# Altium project MCU025A.PrjPcb (part 2 of 2)

## Sheet MCU025A_XDS110_USB_Power.SchDoc
size 431 x 279 mm; Date: Not shown in title block; ApprovedBy: Not shown in title block; CheckedBy: Not shown in title block; Author: Not shown in title block; CompanyName: Not shown in title block; Engineer: Not shown in title block; Organization: Not shown in title block; Address1: Not shown in title block; Address2: Not shown in title block; Address3: Not shown in title block; Address4: Not shown in title block; DocumentNumber: 6; Revision: Use project parameter SCH_Rev; SheetNumber: 6; SheetTotal: 8; PageSetup: Record=PageOptions|CenterHorizontal=True|CenterVertical=True|PrintScale=1.00|XCorrection=1.00|YCorrection=1.00|PrintKind=0|BorderSize=5000000|LeftOffset=0|BottomOffset=0|Orientation=2|PaperLength=1000|PaperWidth=1000|Scale=100|PaperSource=15|PrintQuality=600|MediaType=1|DitherType=10|PaperKind=Letter|PrintScaleMode=1; CurrentTime: Not shown in title block; CurrentDate: Not shown in title block; Time: Not shown in title block; DocumentFullPathAndName: Not shown in title block; DocumentName: Not shown in title block; ModifiedDate: Not shown in title block; ImagePath: Not shown in title block
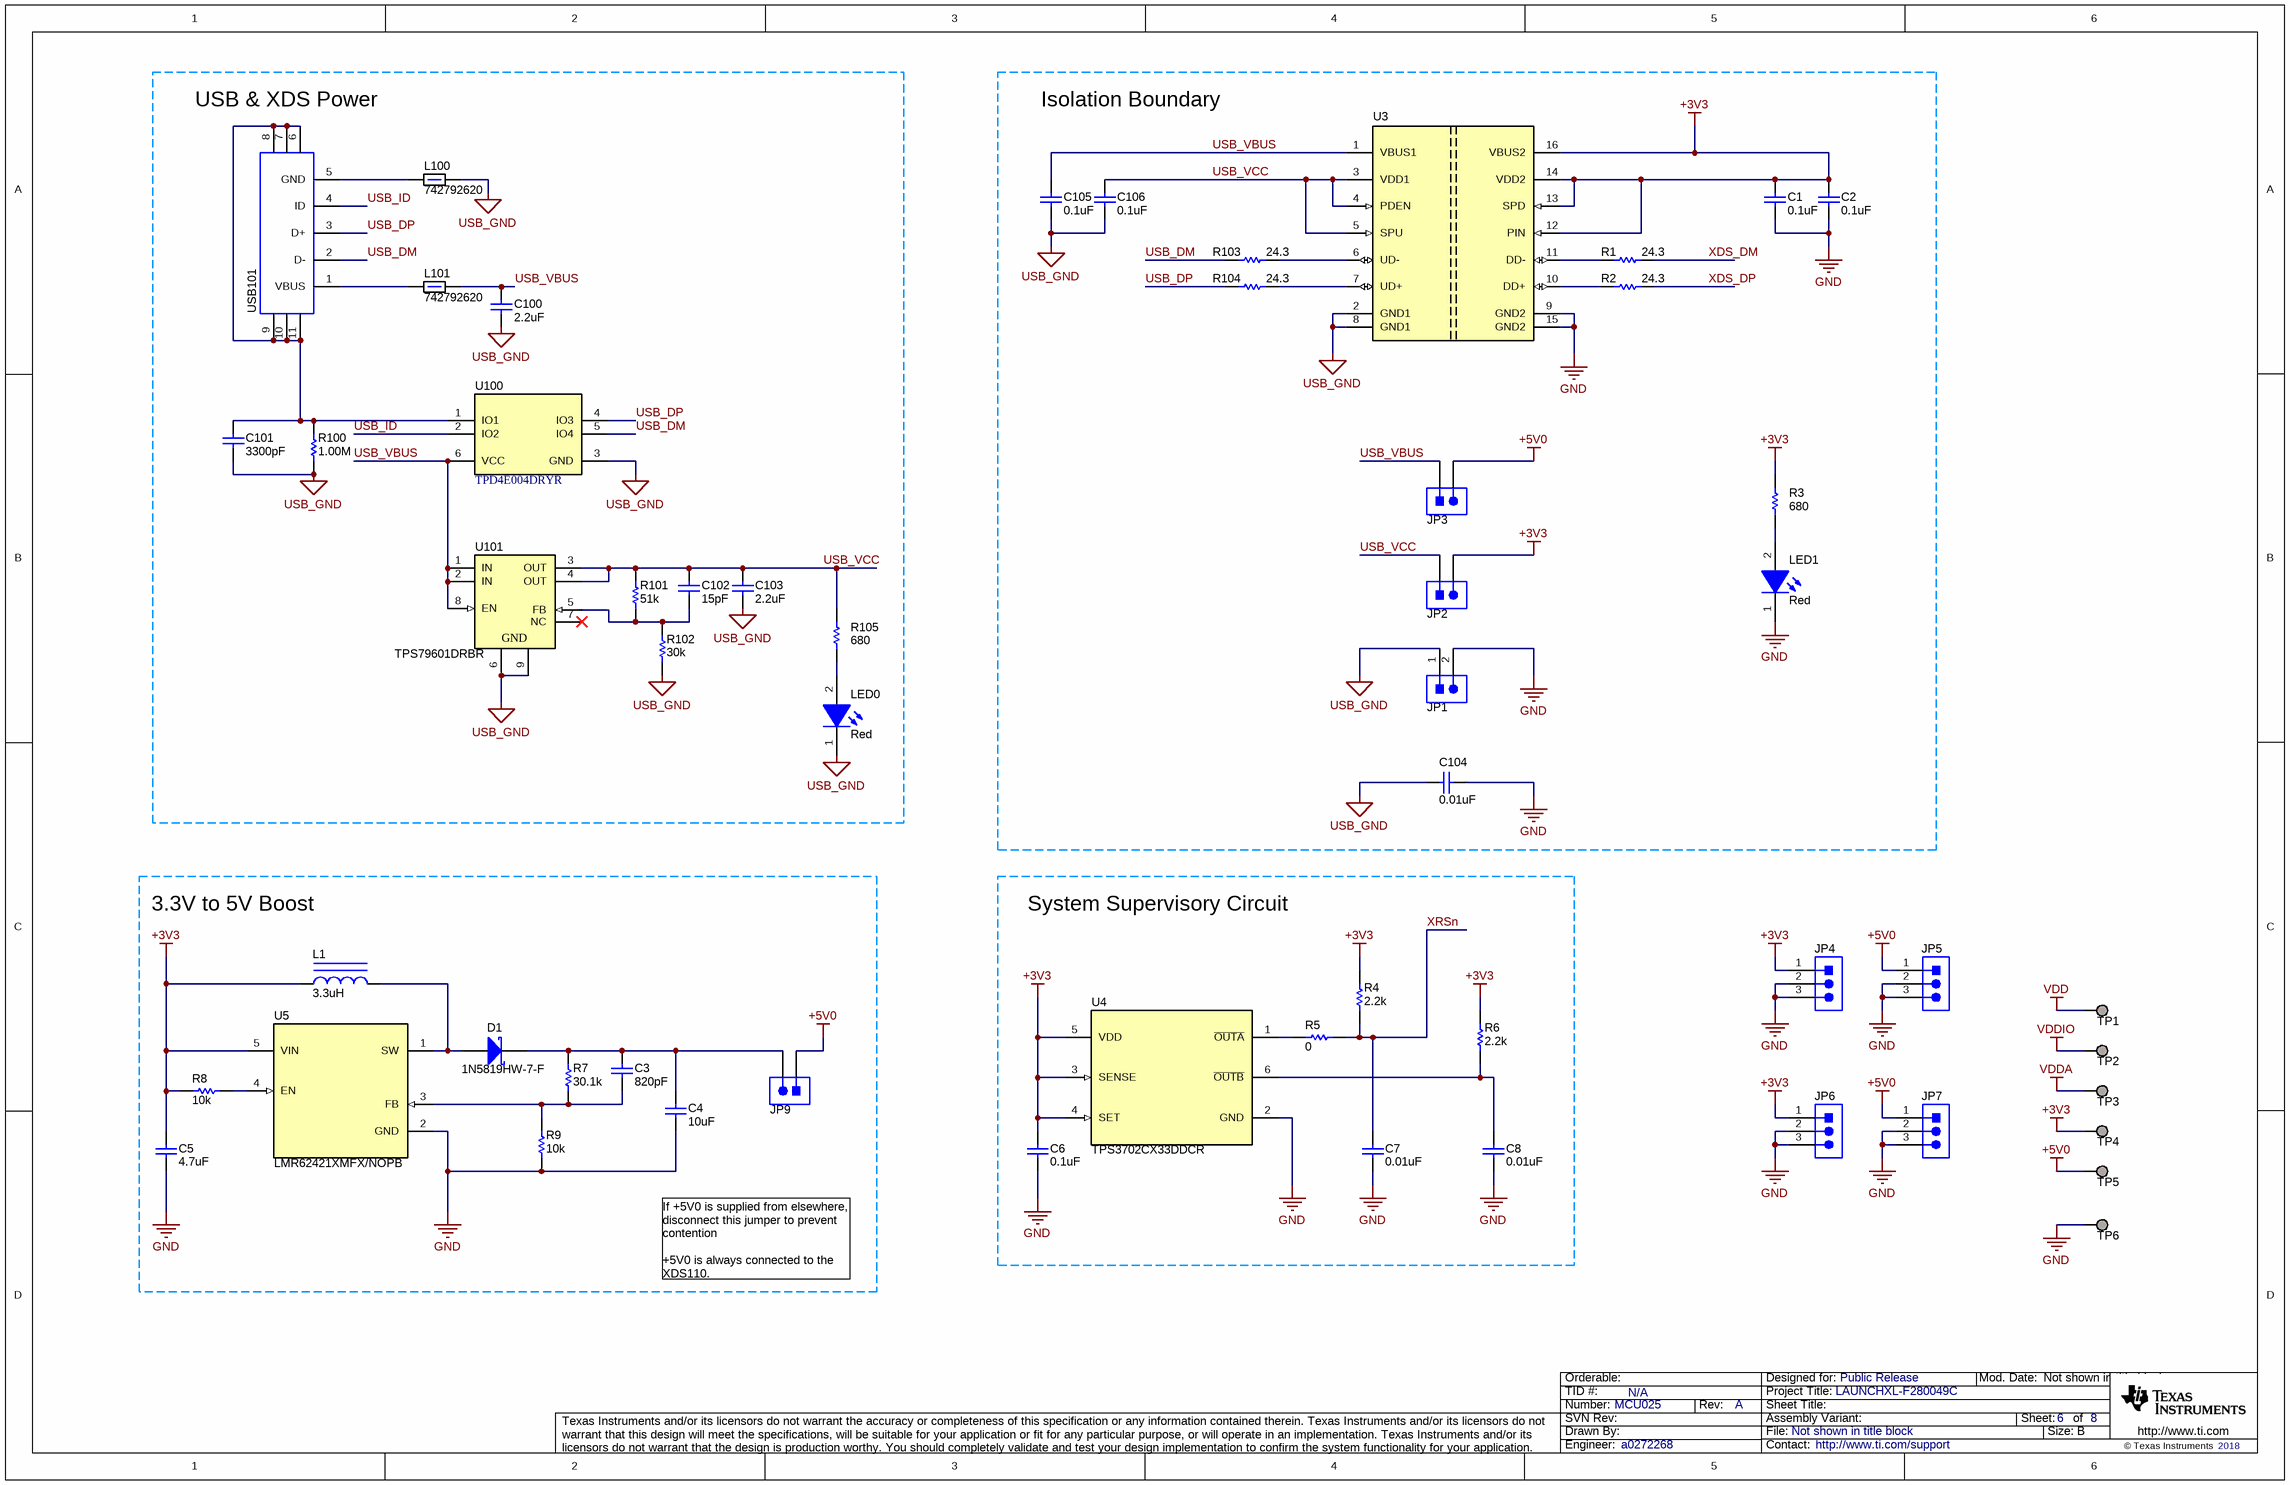
[diagram p2: MCU025A_XDS110_USB_Power.SchDoc]

### Parts
C1  ValueDisplayed: 0.1uF  [0402]  (hidden comment: GRM155R71A104KA01D)
C2  ValueDisplayed: 0.1uF  [0402]  (hidden comment: GRM155R71A104KA01D)
C3  ValueDisplayed: 820pF  [0402]  (hidden comment: GRM1555C1H821JA01D)
C4  ValueDisplayed: 10uF  [1210_220]  (hidden comment: GRM32DR71E106KA12L)
C5  ValueDisplayed: 4.7uF  [0402]  (hidden comment: GRM155R60J475ME47D)
C6  ValueDisplayed: 0.1uF  [0402]  (hidden comment: GRM155R71A104KA01D)
C7  ValueDisplayed: 0.01uF  [0402]  (hidden comment: GRM155R71E103KA01D)
C8  ValueDisplayed: 0.01uF  [0402]  (hidden comment: GRM155R71E103KA01D)
C100  ValueDisplayed: 2.2uF  [0402]  (hidden comment: GRM155R60J225KE95D)
C101  ValueDisplayed: 3300pF  [0402]  (hidden comment: GRM155R71H332KA01D)
C102  ValueDisplayed: 15pF  [0402]  (hidden comment: GRM1555C1H150JA01D)
C103  ValueDisplayed: 2.2uF  [0402]  (hidden comment: GRM155R60J225KE95D)
C104  ValueDisplayed: 0.01uF  [1812]  (hidden comment: 1812SC103KAT1A)
C105  ValueDisplayed: 0.1uF  [0402]  (hidden comment: GRM155R71A104KA01D)
C106  ValueDisplayed: 0.1uF  [0402]  (hidden comment: GRM155R71A104KA01D)
D1  1N5819HW-7-F  [SOD-123]
JP1  61300211121  [WURTH_61300211121]  (value not drawn)
JP2  61300211121  [WURTH_61300211121]  (value not drawn)
JP3  61300211121  [WURTH_61300211121]  (value not drawn)
JP4  61300311121  [WURTH_61300311121]  (value not drawn)
JP5  61300311121  [WURTH_61300311121]  (value not drawn)
JP6  61300311121  [WURTH_61300311121]  (value not drawn)
JP7  61300311121  [WURTH_61300311121]  (value not drawn)
JP9  61300211121  [WURTH_61300211121]  (value not drawn)
L1  ValueDisplayed: 3.3uH  [WE-TPC_2828]  (hidden comment: 744025003)
L100  742792620  [0603]
L101  742792620  [0603]
LED0  value Red  [WL-SMCW_RED_0805]  (hidden comment: 150080SS75000)
LED1  value Red  [WL-SMCW_RED_0805]  (hidden comment: 150080SS75000)
R1  ValueDisplayed: 24.3  [0402]  (hidden comment: CRCW040224R3FKED)
R2  ValueDisplayed: 24.3  [0402]  (hidden comment: CRCW040224R3FKED)
R3  ValueDisplayed: 680  [0402]  (hidden comment: CRCW0402680RJNED)
R4  ValueDisplayed: 2.2k  [0402]  (hidden comment: CRCW04022K20JNED)
R5  ValueDisplayed: 0  [0402]  (hidden comment: CRCW04020000Z0ED)
R6  ValueDisplayed: 2.2k  [0603]  (hidden comment: CRCW06032K20JNEA)
R7  ValueDisplayed: 30.1k  [0402]  (hidden comment: RC0402FR-0730K1L)
R8  ValueDisplayed: 10k  [0402]  (hidden comment: CRCW040210K0JNED)
R9  ValueDisplayed: 10k  [0402]  (hidden comment: CRCW040210K0JNED)
R100  ValueDisplayed: 1.00M  [0402]  (hidden comment: CRCW04021M00FKED)
R101  ValueDisplayed: 51k  [0402]  (hidden comment: CRCW040251K0JNED)
R102  ValueDisplayed: 30k  [0402]  (hidden comment: CRCW040230K0JNED)
R103  ValueDisplayed: 24.3  [0402]  (hidden comment: CRCW040224R3FKED)
R104  ValueDisplayed: 24.3  [0402]  (hidden comment: CRCW040224R3FKED)
R105  ValueDisplayed: 680  [0402]  (hidden comment: CRCW0402680RJNED)
TP1  TESTPOINT  [TESTPOINT]  (value not drawn)  (no BOM)
TP2  TESTPOINT  [TESTPOINT]  (value not drawn)  (no BOM)
TP3  TESTPOINT  [TESTPOINT]  (value not drawn)  (no BOM)
TP4  TESTPOINT  [TESTPOINT]  (value not drawn)  (no BOM)
TP5  TESTPOINT  [TESTPOINT]  (value not drawn)  (no BOM)
TP6  TESTPOINT  [TESTPOINT]  (value not drawn)  (no BOM)
U3  ADuM3160BRWZ  [SOIC-16]  (value not drawn)
U4  TPS3702CX33DDCR  [DDC0006A_N]
U5  LMR62421XMFX/NOPB  [DBV0005A_N]
U100  TPD4E004DRYR  [DRY0006A]
U101  TPS79601DRBR  [DRB0008B]
USB101  1051640001  [Molex_1051640001]  (value not drawn)

### Nets
+3V3: C1.2 C2.2 C5.1 C6.2 JP2.2 JP4.1 JP6.1 L1.1 R3.2 R4.2 R6.2 R8.2 TP4.1 U3.12(PIN) U3.13(SPD) U3.14(VDD2) U3.16(VBUS2) U4.3(SENSE) U4.4(SET) U4.5(VDD) U5.5(VIN)
+5V0: JP3.2 JP5.1 JP7.1 JP9.1 TP5.1
GND: C1.1 C2.1 C4.2 C5.2 C6.1 C7.2 C8.2 C104.1 JP1.2 JP4.2 JP4.3 JP5.2 JP5.3 JP6.2 JP6.3 JP7.2 JP7.3 LED1.1(K) R9.1 TP6.1 U3.9(GND2) U3.15(GND2) U4.2(GND) U5.2(GND)
USB_GND: C100.2 C101.2 C103.2 C104.2 C105.1 C106.1 JP1.1 L100.2 LED0.1(K) R100.1 R102.1 U3.2(GND1) U3.8(GND1) U100.3(GND) U101.6(GND) U101.9(GND)
VDD: TP1.1
VDDA: TP3.1
VDDIO: TP2.1
USB_DM: R103.1 U100.5(IO4) USB101.2(D-)
USB_DP: R104.1 U100.4(IO3) USB101.3(D+)
USB_ID: U100.2(IO2) USB101.4(ID)
USB_VBUS: C100.1 C105.2 JP3.1 L101.2 U3.1(VBUS1) U100.6(VCC) U101.1(IN) U101.2(IN) U101.8(EN)
USB_VCC: C102.1 C103.1 C106.2 JP2.1 R101.2 R105.2 U3.3(VDD1) U3.4(PDEN) U3.5(SPU) U101.3(OUT) U101.4(OUT)
XDS_DM: R1.2
XDS_DP: R2.2
XRSn: C7.1 R4.1 R5.2
NetC3_1: C3.1 C4.1 D1.1(K) JP9.2 R7.2
NetC3_2: C3.2 R7.1 R9.2 U5.3(FB)
NetC8_1: C8.1 R6.1 U4.6(~{OUTB})
NetC101_1: C101.1 R100.2 U100.1(IO1) USB101.6 USB101.7 USB101.8 USB101.9 USB101.10 USB101.11
NetC102_2: C102.2 R101.1 R102.2 U101.5(FB)
NetD1_2: D1.2(A) L1.2 U5.1(SW)
NetL100_1: L100.1 USB101.5(GND)
NetL101_1: L101.1 USB101.1(VBUS)
NetLED0_2: LED0.2(A) R105.1
NetLED1_2: LED1.2(A) R3.1
NetR1_1: R1.1 U3.11(DD-)
NetR2_1: R2.1 U3.10(DD+)
NetR5_1: R5.1 U4.1(~{OUTA})
NetR8_1: R8.1 U5.4(EN)
NetR103_2: R103.2 U3.6(UD-)
NetR104_2: R104.2 U3.7(UD+)

Not connected (* = marked no-connect by the designer): U101 7(NC)*

### Notes on the sheet
- (near USB101) USB & XDS Power
- Isolation Boundary
- 3.3V to 5V Boost
- System Supervisory Circuit
- If +5V0 is supplied from elsewhere, disconnect this jumper to prevent contention
  +5V0 is always connected to the XDS110.
- Drawn By:
- SVN Rev:
- Number:
- TID #:
- Orderable:
- Rev:
- Sheet Title:
- File:
- Project Title:
- Designed for:
- Assembly Variant:
- Mod. Date:
- Sheet:
- Size:
- of
- B
- http://www.ti.com
- Texas Instruments and/or its licensors do not warrant the accuracy or completeness of this specification or any information contained therein. Texas Instruments and/or its licensors do not warrant that this design will meet the specifications, will be suitable for your application or fit for any particular purpose, or will operate in an implementation. Texas Instruments and/or its licensors do not warrant that the design is production worthy. You should completely validate and test your design implementation to confirm the system functionality for your application.
- Engineer:
- Contact:
- © Texas Instruments

### Library data of the parts
C1 C2 C6 C105 C106 = CMP-0006629-2: CAP, CERM, 0.1 uF, 10 V, +/- 10%, X7R, 0402; Manufacturer: MuRata; Polarized: N; Value: 0.1uF; U/M: EA; Cap_F: 100nF; Value1: Unknown; VDC_V: 10V; TaMin_C: -55°C; TaMax_C: 125°C; SizeArea_mm2: 0.5; SizeAreaWB_mm2: 3; SizeX_mm: 1; SizeZ_mm: 0.6; AEC Category: Q200; CompType: Capacitor; PartNumber: GRM155R71A104KA01D; PackageReference: 0402; RoHS: Y; Tolerance_%: 10%; Value2: 10V; MountType: SMT; Technology: Ceramic; TempCo: X7R; Cap_Case: 0402; SizeY_mm: 0.5; Published: 2008-06-19; Publisher: Texas Instruments; LatestRevisionDate: 2017-03-09; ComponentLink1Description: Datasheet link; ComponentLink1URL: http://search.murata.co.jp/Ceramy/PnsearchViewAction.do?HnOFG=ON&HnNFG=ON&SEL_CNT=50&sLang=en&sKey=GRM155R71A104KA01D&x=9&y=9&search=startwith; Supplier 1: Digi-Key; Supplier Part Number 1: GRM155R71A104KA01D-ND; Supplier 2: Newark; Supplier Part Number 2: 14T3278; Supplier 3: Mouser; Supplier Part Number 3: 81-GRM155R71A104KA1D; AEC Qualified: ?
C3 = CMP-0006493-2: CAP, CERM, 820 pF, 50 V, +/- 5%, C0G/NP0, 0402; Manufacturer: MuRata; Polarized: N; Value: 820pF; U/M: EA; Value1: Unknown; VDC_V: 50V; TaMin_C: -55°C; TaMax_C: 125°C; SizeArea_mm2: 0.5; SizeAreaWB_mm2: 3; SizeX_mm: 1; SizeZ_mm: 0.6; AEC Category: Q200; CompType: Capacitor; PartNumber: GRM1555C1H821JA01D; PackageReference: 0402; RoHS: Y; Cap_F: 820pF; Tolerance_%: 5%; Value2: 50V; MountType: SMT; Technology: Ceramic; TempCo: C0G/NP0; Cap_Case: 0402; SizeY_mm: 0.5; Published: 2008-06-19; Publisher: Texas Instruments; LatestRevisionDate: 2017-03-09; ComponentLink1Description: Datasheet link; ComponentLink1URL: http://search.murata.co.jp/Ceramy/PnsearchViewAction.do?HnOFG=ON&HnNFG=ON&SEL_CNT=50&sLang=en&sKey=GRM1555C1H821JA01D&x=9&y=9&search=startwith; Supplier 1: Digi-Key; Supplier Part Number 1: 490-3242-1-ND; Supplier 2: Mouser; Supplier Part Number 2: 81-GRM1555C1H821JA1D; AEC Qualified: ?
C4 = CMP-0009190-2: CAP, CERM, 10 uF, 25 V, +/- 10%, X7R, 1210; Manufacturer: MuRata; Polarized: N; Value: 10uF; U/M: EA; Cap_F: 10µF; Value1: Unknown; VDC_V: 25V; TaMin_C: -55°C; TaMax_C: 125°C; Cap_Case: 1210; SizeArea_mm2: 8; SizeAreaWB_mm2: 14.7; SizeX_mm: 3.2; SizeY_mm: 2.5; SizeZ_mm: 2.2; AEC Category: Q200; CompType: Capacitor; PartNumber: GRM32DR71E106KA12L; PackageReference: 1210; RoHS: Y; Tolerance_%: 10%; Value2: 25V; MountType: SMT; Technology: Ceramic; TempCo: X7R; Published: 2008-06-19; Publisher: Texas Instruments; LatestRevisionDate: 2017-03-09; ComponentLink1Description: Datasheet link; ComponentLink1URL: http://search.murata.co.jp/Ceramy/image/img/A01X/G101/ENG/GRM32DR71E106KA12-01.pdf; Supplier 1: Digi-Key; Supplier Part Number 1: 490-1867-1-ND; Supplier 2: Newark; Supplier Part Number 2: 14T3400; Supplier 3: Mouser; Supplier Part Number 3: 81-GRM32DR71E106KA12; AEC Qualified: N; AEC Grade: N/A
C5 = CMP-0006552-2: CAP, CERM, 4.7 uF, 6.3 V, +/- 20%, X5R, 0402; Manufacturer: MuRata; Polarized: N; Value: 4.7uF; U/M: EA; Cap_F: 4.7µF; Value1: Unknown; VDC_V: 6.3V; TaMin_C: -55°C; TaMax_C: 85°C; SizeArea_mm2: 0.5; SizeAreaWB_mm2: 3; SizeX_mm: 1; SizeZ_mm: 0.6; AEC Category: Q200; CompType: Capacitor; PartNumber: GRM155R60J475ME47D; PackageReference: 0402; RoHS: Y; Tolerance_%: 20%; Value2: 6.3V; MountType: SMT; Technology: Ceramic; TempCo: X5R; Cap_Case: 0402; SizeY_mm: 0.5; Published: 2008-06-19; Publisher: Texas Instruments; LatestRevisionDate: 2017-03-09; ComponentLink1Description: Datasheet link; ComponentLink1URL: http://www.murata.com/products/catalog/pdf/c02e.pdf; Supplier 1: Digi-Key; Supplier Part Number 1: 490-5915-1-ND; AEC Qualified: ?
C7 C8 = CMP-0006658-2: CAP, CERM, 0.01 uF, 25 V, +/- 10%, X7R, 0402; Manufacturer: MuRata; Polarized: N; Value: 0.01uF; U/M: EA; Cap_F: 10nF; Value1: Unknown; VDC_V: 25V; TaMin_C: -55°C; TaMax_C: 125°C; SizeArea_mm2: 0.5; SizeAreaWB_mm2: 3; SizeX_mm: 1; SizeZ_mm: 0.6; AEC Category: Q200; CompType: Capacitor; PartNumber: GRM155R71E103KA01D; PackageReference: 0402; RoHS: Y; Tolerance_%: 10%; Value2: 25V; MountType: SMT; Technology: Ceramic; TempCo: X7R; Cap_Case: 0402; SizeY_mm: 0.5; Published: 2008-06-19; Publisher: Texas Instruments; LatestRevisionDate: 2017-03-09; ComponentLink1Description: Datasheet link; ComponentLink1URL: http://search.murata.co.jp/Ceramy/PnsearchViewAction.do?HnOFG=ON&HnNFG=ON&SEL_CNT=50&sLang=en&sKey=GRM155R71E103KA01D&x=9&y=9&search=startwith; Supplier 1: Digi-Key; Supplier Part Number 1: 490-1312-1-ND; Supplier 2: Mouser; Supplier Part Number 2: 81-GRM36X103K25; Supplier 3: Farnell; Supplier Part Number 3: 8819734; AEC Qualified: ?
C100 C103 = CMP-0006543-2: CAP, CERM, 2.2 uF, 6.3 V, +/- 10%, X5R, 0402; Manufacturer: MuRata; Polarized: N; Value: 2.2uF; U/M: EA; Cap_F: 2.2µF; Value1: Unknown; VDC_V: 6.3V; TaMin_C: -55°C; TaMax_C: 85°C; SizeArea_mm2: 0.5; SizeAreaWB_mm2: 3; SizeX_mm: 1; SizeZ_mm: 0.6; AEC Category: Q200; CompType: Capacitor; PartNumber: GRM155R60J225KE95D; PackageReference: 0402; RoHS: Y; Tolerance_%: 10%; Value2: 6.3V; MountType: SMT; Technology: Ceramic; TempCo: X5R; Cap_Case: 0402; SizeY_mm: 0.5; Published: 2008-06-19; Publisher: Texas Instruments; LatestRevisionDate: 2017-03-09; ComponentLink1Description: Datasheet link; ComponentLink1URL: http://psearch.en.murata.com/capacitor/product/GRM155R60J225KE95%23.pdf; Supplier 1: Mouser; Supplier Part Number 1: 81-GRM155R60J225KE5D; AEC Qualified: N; AEC Grade: N/A
C101 = CMP-0006688-2: CAP, CERM, 3300 pF, 50 V, +/- 10%, X7R, 0402; Manufacturer: MuRata; Polarized: N; Value: 3300pF; U/M: EA; Cap_F: 3.3nF; Value1: Unknown; VDC_V: 50V; TaMin_C: -55°C; TaMax_C: 125°C; SizeArea_mm2: 0.5; SizeAreaWB_mm2: 3; SizeX_mm: 1; SizeZ_mm: 0.6; AEC Category: Q200; CompType: Capacitor; PartNumber: GRM155R71H332KA01D; PackageReference: 0402; RoHS: Y; Tolerance_%: 10%; Value2: 50V; MountType: SMT; Technology: Ceramic; TempCo: X7R; Cap_Case: 0402; SizeY_mm: 0.5; Published: 2008-06-19; Publisher: Texas Instruments; LatestRevisionDate: 2017-03-09; ComponentLink1Description: Datasheet link; ComponentLink1URL: http://search.murata.co.jp/Ceramy/PnsearchViewAction.do?HnOFG=ON&HnNFG=ON&SEL_CNT=50&sLang=en&sKey=GRM155R71H332KA01D&x=9&y=9&search=startwith; Supplier 1: Digi-Key; Supplier Part Number 1: 490-3248-1-ND; Supplier 2: Mouser; Supplier Part Number 2: 81-GRM36X332K50; AEC Qualified: ?
C102 = CMP-0006420-2: CAP, CERM, 15 pF, 50 V, +/- 5%, C0G/NP0, 0402; Manufacturer: MuRata; Polarized: N; Value: 15pF; U/M: EA; Value1: Unknown; VDC_V: 50V; TaMin_C: -55°C; TaMax_C: 125°C; SizeArea_mm2: 0.5; SizeAreaWB_mm2: 3; SizeX_mm: 1; SizeZ_mm: 0.6; AEC Category: Q200; CompType: Capacitor; PartNumber: GRM1555C1H150JA01D; PackageReference: 0402; RoHS: Y; Cap_F: 15pF; Tolerance_%: 5%; Value2: 50V; MountType: SMT; Technology: Ceramic; TempCo: C0G/NP0; Cap_Case: 0402; SizeY_mm: 0.5; Published: 2008-06-19; Publisher: Texas Instruments; LatestRevisionDate: 2017-03-09; ComponentLink1Description: Datasheet link; ComponentLink1URL: http://search.murata.co.jp/Ceramy/PnsearchViewAction.do?HnOFG=ON&HnNFG=ON&SEL_CNT=50&sLang=en&sKey=GRM1555C1H150JA01D&x=9&y=9&search=startwith; Supplier 1: Mouser; Supplier Part Number 1: 81-GRM1555C1H150JA1D; AEC Qualified: ?
C104 = CMP-0009297-2: CAP, CERM, 0.01 uF, 1500 V, +/- 10%, X7R, 1812; Manufacturer: AVX; Polarized: N; Value: 0.01uF; U/M: EA; Cap_F: 10nF; ESR_ohm: 0.05; Value1: 0.05 ohm; VDC_V: 1.5kV; Value2: 1500V; TaMin_C: -55°C; TaMax_C: 125°C; SizeArea_mm2: 14.4; SizeAreaWB_mm2: 23.1; SizeX_mm: 4.5; SizeY_mm: 3.2; SizeZ_mm: 1.35; AEC Category: Q200; CompType: Capacitor; PartNumber: 1812SC103KAT1A; PackageReference: 1812; RoHS: Y; Tolerance_%: 10%; MountType: SMT; Technology: Ceramic; TempCo: X7R; Cap_Case: 1812; Published: 2008-06-19; Publisher: Texas Instruments; LatestRevisionDate: 2017-03-09; ComponentLink1Description: Datasheet link; ComponentLink1URL: http://datasheets.avx.com/AVX-HV_MLCC.pdf; Supplier 1: Digi-Key; Supplier Part Number 1: 478-4735-1-ND; Supplier 2: Newark; Supplier Part Number 2: 96M1562; Supplier 3: Mouser; Supplier Part Number 3: 581-1812SC103KAT1A; AEC Qualified: N; AEC Grade: N/A
D1 = CMP-0028360-1: Diode, Schottky, 40 V, 1 A, SOD-123; Manufacturer: Diodes Inc.; U/M: EA; Vf_V: 4.5dV; Value: 40V; Value1: 1A; Value2: 0.45V; TJmax_C: 125°C; SizeAreaWB_mm2: 13.095; SizeArea_mm2: 6.545; SizeX_mm: 3.85; SizeY_mm: 1.7; SizeZ_mm: 1.35; AEC Category: Q101; Green_Lifecycle: Active; Green_REACh: Passed; CompType: Diode; PartNumber: 1N5819HW-7-F; PackageReference: SOD-123; Io_A: 1A; Vr_V: 40V; MountType: SMT; Type: Schottky; RoHS: Y; Published: 2008-06-26; Publisher: Texas Instruments; LatestRevisionDate: 2017-05-08; ComponentLink1Description: Datasheet link; ComponentLink1URL: http://www.diodes.com/datasheets/ds30217.pdf; Supplier 1: Digi-Key; Supplier Part Number 1: 1N5819HW-FDICT-ND; Supplier 2: Mouser; Supplier Part Number 2: 621-1N5819HW-F; Supplier 3: Farnell; Supplier Part Number 3: 1773475; AEC Qualified: ?; Green_EU RoHS: Passed; Green_EU RoHS-2: Passed
JP1-JP3 JP9 = CMP-0054794-1: Header, 2.54 mm, 2x1, Gold, TH; Manufacturer: Wurth Elektronik; Green_Lifecycle: Active; Green_REACh: Passed; CNHeader: TRUE; CT: FALSE; PartNumber: 61300211121; PackageReference: Header, 2.54mm, 2x1, TH; ClassName: Header; CompType: Header; RoHS: Y; MountType: TH; ComponentLink1Description: Datasheet URL; ComponentLink1URL: http://katalog.we-online.de/em/datasheet/6130xx11121.pdf; Publisher: Texas Instruments; LatestRevisionDate: 26/05/2017; Supplier 1: Digi-Key; Supplier Part Number 1: 732-5315-ND; Supplier 2: Newark; Supplier Part Number 2: 20X0948; Supplier 3: Mouser; Supplier Part Number 3: 710-61300211121; Green_EU RoHS: Passed; Green_EU RoHS-2: Incomplete
JP4-JP7 = CMP-0054796-1: Header, 2.54 mm, 3x1, Gold, TH; Manufacturer: Wurth Elektronik; Green_Lifecycle: Active; Green_REACh: Passed; CNHeader: TRUE; CT: FALSE; PartNumber: 61300311121; PackageReference: Header, 2.54mm, 3x1, TH; ClassName: Header; CompType: Header; RoHS: Y; MountType: TH; ComponentLink1Description: Datasheet URL; ComponentLink1URL: http://katalog.we-online.de/em/datasheet/6130xx11121.pdf; Publisher: Texas Instruments; LatestRevisionDate: 26/05/2017; Supplier 1: Digi-Key; Supplier Part Number 1: 732-5316-ND; Supplier 2: Newark; Supplier Part Number 2: 20X0950; Supplier 3: Farnell; Supplier Part Number 3: 356154; Green_EU RoHS: Passed; Green_EU RoHS-2: Incomplete
L1 = CMP-0063754-1: Inductor, Shielded Drum Core, Ferrite, 3.3 uH, 1.5 A, 0.085 ohm, SMD; Manufacturer: Wurth Elektronik; Value: 3.3uH; Ind_H: 3.3µH; Imax_A: 1.5A; Irms: 1.5A @ 40C rise; Isat: 1.8A @ 35% inductance drop; DCR_ohm: 0.085; SizeAreaWB_mm2: 14.44; SizeArea_mm2: 7.84; SizeX_mm: 2.8; SizeZ_mm: 3; AEC Category: Q200; Green_Lifecycle: Active; Green_REACh: Passed; CompType: Inductor; PartNumber: 744025003; Value1: 0.085 ohm; Value2: 1.5A; Technology: Shielded Drum Core; MountType: SMT; Material: Ferrite; PackageReference: Inductor, 2.8x2.8x2.8mm; Published: 2008-06-26; Publisher: Texas Instruments; LatestRevisionDate: 2017-06-02; ComponentLink1Description: Datasheet link; ComponentLink1URL: http://katalog.we-online.de/kataloge/eisos/media/pdf/744025003.pdf; RoHS: Y; SizeY_mm: 2.8; Supplier 1: Digi-Key; Supplier Part Number 1: 732-2614-1-ND; AEC Qualified: ?; Green_EU RoHS: Passed; Green_EU RoHS-2: Incomplete
L100 L101 = CMP-0003183-2: Ferrite Bead, 100 ohm @ 100 MHz, 0.5 A, 0603; Manufacturer: Wurth Elektronik; Ztyp@1GHz_Ohm: 137.267; ZTyp@100MHz_Ohm: 100; SizeAreaWB_mm2: 4.68; DCR_ohm: 1.5d; Value1: 0.15 ohm; Value: 100 ohm; Imax_A: 5dA; SizeZ_mm: 1; SizeX_mm: 1.6; SizeY_mm: 0.8; Value2: 0.5A; SizeArea_mm2: 1.28; ComponentLink1URL: http://katalog.we-online.de/pbs/datasheet/742792620.pdf; Supplier Part Number 2: 710-742792620; Publisher: Texas Instruments; Supplier 2: Mouser; Published: 2014-04-30; RoHS: Y; MountType: SMT; Supplier 1: Digi-Key; PackageReference: 0603; CompType: Ferrite Bead; LatestRevisionDate: 2017-03-09; PartNumber: 742792620; ComponentLink1Description: Datasheet link; Supplier Part Number 1: 732-1579-1-ND; ValueDisplayed: 100 ohm
LED0 LED1 = CMP-0002951-2: LED, Red, SMD; Manufacturer: Wurth Elektronik; Type: AlInGaP; Vf_V: 1.9V; Io_A: 30mA; Vr_V: 5V; Ir_A: 25µA; Tjmax_C: 85°C; Power_TotalModule: 72mW; Value1: 0.072W; Angle: 140; U/M: EA; CompType: LED; PartNumber: 150080SS75000; MountType: SMT; RoHS: Y; PackageReference: LED_0805; Value2: 1.9V; Color: Red; Published: 2008-07-11; Publisher: Texas Instruments; ComponentLink1URL: http://katalog.we-online.de/led/datasheet/150080SS75000.pdf; ComponentLink1Description: Datasheet link; LatestRevisionDate: 2017-03-09; Supplier 1: Digi-Key; Supplier Part Number 1: 732-4985-1-ND; Supplier 2: Newark; Supplier Part Number 2: 95W3802; Supplier 3: Mouser; Supplier Part Number 3: 710-150080SS75000
R1 R2 R103 R104 = CMP-0026197-2: RES, 24.3, 1%, 0.063 W, AEC-Q200 Grade 0, 0402; Manufacturer: Vishay-Dale; Value: 24.3; Value_Code: 24R3; Power_W: 63mW; Value2: 0.063W; VDC_V: 50V; TempCo: 100 ppm/C; SizeArea_mm2: 0.5; SizeX_mm: 1; SizeZ_mm: 0.6; EIA_Code: E96; AEC Category: Q200; AEC Qualified: Y; AEC Grade: 0; CompType: Resistor; PartNumber: CRCW040224R3FKED; PackageReference: 0402; RoHS: E; Res_ohm: 24.3; Tolerance_%: 1%; Value1: 1%; MountType: SMT; Technology: Thick Film; SizeY_mm: 0.5; ComponentLink1Description: Datasheet link; ComponentLink1URL: http://www.vishay.com/docs/20035/dcrcwe3.pdf; Supplier 1: Digi-Key; Supplier Part Number 1: 541-24.3LCT-ND; Supplier 2: Newark; Supplier Part Number 2: 52K6877; Supplier 3: Mouser; Supplier Part Number 3: 71-CRCW0402-24.3-E3
R3 R105 = CMP-0026962-3: RES, 680, 5%, 0.063 W, AEC-Q200 Grade 0, 0402; Manufacturer: Vishay-Dale; Power_W: 63mW; TempCo: 200 ppm/C; Value_Code: 680R; Value: 680; EIA_Code: E24; SizeX_mm: 1; SizeY_mm: 0.5; SizeZ_mm: 0.6; Value2: 0.063W; CompType: Resistor; AEC Qualified: Y; VDC_V: 50V; AEC Category: Q200; AEC Grade: 0; Supplier Part Number 2: 59M6744; Supplier 2: Newark; Supplier Part Number 3: 71-CRCW0402J-680-E3; Supplier 3: Mouser; RoHS: E; Value1: 5%; MountType: SMT; Supplier 1: Digi-Key; PackageReference: 0402; Tolerance_%: 5%; Res_ohm: 680; SizeArea_mm2: 0.5; PartNumber: CRCW0402680RJNED; ComponentLink1Description: Datasheet link; Supplier Part Number 1: 541-680JCT-ND; Technology: Thick Film; ComponentLink1URL: http://www.vishay.com/docs/20035/dcrcwe3.pdf
R4 = CMP-0026890-5: RES, 2.2 k, 5%, 0.063 W, AEC-Q200 Grade 0, 0402; Manufacturer: Vishay-Dale; Value: 2.2k; Value_Code: 2k20; Power_W: 63mW; Value2: 0.063W; VDC_V: 50V; TempCo: 200 ppm/C; SizeArea_mm2: 0.5; SizeX_mm: 1; SizeZ_mm: 0.6; EIA_Code: E24; AEC Category: Q200; AEC Qualified: Y; AEC Grade: 0; CompType: Resistor; PartNumber: CRCW04022K20JNED; PackageReference: 0402; RoHS: E; Res_ohm: 2.2k; Tolerance_%: 5%; Value1: 5%; MountType: SMT; Technology: Thick Film; SizeY_mm: 0.5; ComponentLink1Description: Datasheet link; ComponentLink1URL: http://www.vishay.com/docs/20035/dcrcwe3.pdf; Supplier 1: Digi-Key; Supplier Part Number 1: 541-2.2KJCT-ND; Supplier 2: Newark; Supplier Part Number 2: 59M6710; Supplier 3: Mouser; Supplier Part Number 3: 71-CRCW0402J-2.2K-E3
R5 = CMP-0026822-3: RES, 0, 5%, 0.063 W, AEC-Q200 Grade 0, 0402; Manufacturer: Vishay-Dale; Value: 0; Value_Code: 0000; Power_W: 63mW; Value2: 0.063W; VDC_V: 50V; TempCo: 200 ppm/C; SizeArea_mm2: 0.5; SizeX_mm: 1; SizeZ_mm: 0.6; EIA_Code: E24; AEC Category: Q200; AEC Qualified: Y; CompType: Resistor; PartNumber: CRCW04020000Z0ED; PackageReference: 0402; RoHS: E; Res_ohm: 0; Tolerance_%: 5%; Value1: 5%; MountType: SMT; Technology: Thick Film; SizeY_mm: 0.5; ComponentLink1Description: Datasheet link; ComponentLink1URL: http://www.vishay.com/docs/20035/dcrcwe3.pdf; Supplier 1: Digi-Key; Supplier Part Number 1: 541-0.0JCT-ND; Supplier 2: Newark; Supplier Part Number 2: 52K6543; Supplier 3: Mouser; Supplier Part Number 3: 71-CRCW0402-0-E3; AEC Grade: 0
R6 = CMP-0025769-4: RES, 2.2 k, 5%, 0.1 W, AEC-Q200 Grade 0, 0603; Manufacturer: Vishay-Dale; Value: 2.2k; Value_Code: 2k20; Power_W: 100mW; Value2: 0.1W; VDC_V: 75V; TempCo: 200 ppm/C; SizeArea_mm2: 1.28; SizeX_mm: 1.6; SizeY_mm: 0.8; SizeZ_mm: 1; EIA_Code: E24; AEC Category: Q200; AEC Qualified: Y; AEC Grade: 0; CompType: Resistor; PartNumber: CRCW06032K20JNEA; PackageReference: 0603; RoHS: E; Res_ohm: 2.2k; Tolerance_%: 5%; Value1: 5%; MountType: SMT; Technology: Thick Film; ComponentLink1Description: Datasheet link; ComponentLink1URL: http://www.vishay.com/docs/20035/dcrcwe3.pdf; Supplier 1: Digi-Key; Supplier Part Number 1: 541-2.2KGCT-ND; Supplier 2: Newark; Supplier Part Number 2: 59M6776; Supplier 3: Farnell; Supplier Part Number 3: 1652868
R7 = CMP-0026730-1: RES, 30.1 k, 1%, 0.063 W, 0402; Manufacturer: Yageo America; Value: 30.1k; Value_Code: 30k1; Power_W: 63mW; Value2: 0.063W; VDC_V: 50V; TempCo: 100 ppm/C; SizeArea_mm2: 0.5; SizeX_mm: 1; SizeZ_mm: 0.6; EIA_Code: E96; U/M: EA; AEC Category: Q200; AEC Qualified: N; CompType: Resistor; PartNumber: RC0402FR-0730K1L; PackageReference: 0402; RoHS: Y; Res_ohm: 30.1k; Tolerance_%: 1%; Value1: 1%; MountType: SMT; Technology: Thick Film; SizeY_mm: 0.5; Published: 2008-06-26; Publisher: Texas Instruments; LatestRevisionDate: 2017-03-09; ComponentLink1Description: Datasheet link; ComponentLink1URL: http://www.yageo.com/documents/recent/PYu-RC_Group_51_RoHS_L_04.pdf; Supplier 1: Digi-Key; Supplier Part Number 1: 311-30.1KLRCT-ND; Supplier 2: Newark; Supplier Part Number 2: 18X9891; Supplier 3: Mouser; Supplier Part Number 3: 603-RC0402FR-0730K1; AEC Grade: N/A
R8 R9 = CMP-0026825-5: RES, 10 k, 5%, 0.063 W, AEC-Q200 Grade 0, 0402; Manufacturer: Vishay-Dale; Value: 10k; Value_Code: 10k0; Power_W: 63mW; Value2: 0.063W; VDC_V: 50V; TempCo: 200 ppm/C; SizeArea_mm2: 0.5; SizeX_mm: 1; SizeZ_mm: 0.6; EIA_Code: E24; AEC Category: Q200; AEC Qualified: Y; AEC Grade: 0; CompType: Resistor; PartNumber: CRCW040210K0JNED; PackageReference: 0402; RoHS: E; Res_ohm: 10k; Tolerance_%: 5%; Value1: 5%; MountType: SMT; Technology: Thick Film; SizeY_mm: 0.5; ComponentLink1Description: Datasheet link; ComponentLink1URL: http://www.vishay.com/docs/20035/dcrcwe3.pdf; Supplier 1: Digi-Key; Supplier Part Number 1: 541-10KJCT-ND; Supplier 2: Newark; Supplier Part Number 2: 59M6696; Supplier 3: Mouser; Supplier Part Number 3: 71-CRCW0402J-10K-E3
R100 = CMP-0026100-2: RES, 1.00 M, 1%, 0.063 W, AEC-Q200 Grade 0, 0402; Manufacturer: Vishay-Dale; Value: 1.00Meg; Res_ohm: 1M; Value_Code: 1M00; Power_W: 63mW; Value2: 0.063W; VDC_V: 50V; TempCo: 100 ppm/C; SizeArea_mm2: 0.5; SizeX_mm: 1; SizeZ_mm: 0.6; EIA_Code: E96; AEC Category: Q200; AEC Qualified: Y; AEC Grade: 0; CompType: Resistor; PartNumber: CRCW04021M00FKED; PackageReference: 0402; RoHS: E; Tolerance_%: 1%; Value1: 1%; MountType: SMT; Technology: Thick Film; SizeY_mm: 0.5; ComponentLink1Description: Datasheet link; ComponentLink1URL: http://www.vishay.com/docs/20035/dcrcwe3.pdf; Supplier 1: Digi-Key; Supplier Part Number 1: 541-1.00MLCT-ND; Supplier 2: Newark; Supplier Part Number 2: 52K6593; Supplier 3: Mouser; Supplier Part Number 3: 71-CRCW0402-1.0M-E3
R101 = CMP-0026945-3: RES, 51 k, 5%, 0.063 W, AEC-Q200 Grade 0, 0402; Manufacturer: Vishay-Dale; Value: 51k; Value_Code: 51k0; Power_W: 63mW; Value2: 0.063W; VDC_V: 50V; TempCo: 200 ppm/C; SizeArea_mm2: 0.5; SizeX_mm: 1; SizeZ_mm: 0.6; EIA_Code: E24; AEC Category: Q200; AEC Qualified: Y; AEC Grade: 0; CompType: Resistor; PartNumber: CRCW040251K0JNED; PackageReference: 0402; RoHS: E; Res_ohm: 51k; Tolerance_%: 5%; Value1: 5%; MountType: SMT; Technology: Thick Film; SizeY_mm: 0.5; ComponentLink1Description: Datasheet link; ComponentLink1URL: http://www.vishay.com/docs/20035/dcrcwe3.pdf; Supplier 1: Digi-Key; Supplier Part Number 1: 541-51KJCT-ND; Supplier 2: Newark; Supplier Part Number 2: 89M6676; Supplier 3: Mouser; Supplier Part Number 3: 71-CRCW0402J-51K-E3
R102 = CMP-0026903-3: RES, 30 k, 5%, 0.063 W, AEC-Q200 Grade 0, 0402; Manufacturer: Vishay-Dale; Value: 30k; Value_Code: 30k0; Power_W: 63mW; Value2: 0.063W; VDC_V: 50V; TempCo: 200 ppm/C; SizeArea_mm2: 0.5; SizeX_mm: 1; SizeZ_mm: 0.6; EIA_Code: E24; AEC Category: Q200; AEC Qualified: Y; AEC Grade: 0; CompType: Resistor; PartNumber: CRCW040230K0JNED; PackageReference: 0402; RoHS: E; Res_ohm: 30k; Tolerance_%: 5%; Value1: 5%; MountType: SMT; Technology: Thick Film; SizeY_mm: 0.5; ComponentLink1Description: Datasheet link; ComponentLink1URL: http://www.vishay.com/docs/20035/dcrcwe3.pdf; Supplier 1: Digi-Key; Supplier Part Number 1: 541-30KJCT-ND; Supplier 2: Newark; Supplier Part Number 2: 59M6726; Supplier 3: Mouser; Supplier Part Number 3: 71-CRCW0402J-30K-E3
TP1-TP6 = CMP-0078143-2: TEST POINT.  No entry in BOM.; CompType: Testpoint; PackageReference: N/A; Manufacturer: N/A; PartNumber: N/A; Library Reference: TESTPOINT
U3 = CMP-0074604-2: Full/Low Speed 2.5 kV USB Digital Isolator, SOIC-16; Manufacturer: Analog Devices; PartNumber: ADuM3160BRWZ; MountType: SMT; ComponentLink1Description: Datasheet URL; ComponentLink1URL: http://www.analog.com/media/en/technical-documentation/data-sheets/ADuM3160.pdf; RoHS: Y; PackageReference: SOIC, 16-Leads, Body 10.3x7.5mm, Pitch 1.27mm; Publisher: Texas Instruments; LatestRevisionDate: 2017-06-16; Supplier 1: Digi-Key; Supplier Part Number 1: ADUM3160BRWZ-ND; Supplier 2: Newark; Supplier Part Number 2: 85R6420; Supplier 3: Mouser; Supplier Part Number 3: 584-ADUM3160BRWZ
U4 = CMP-0067340-2: High-Accuracy, Fixed-Threshold OV/UV Monitor, DDC0006A (SOT-23-T-6); Alternate PartNumber: TPS3702CX33DDCT; Manufacturer: Texas Instruments; SizeArea_mm2: 4.8675; SizeAreaWB_mm2: 10.4675; SizeX_mm: 1.65; SizeY_mm: 2.95; SizeZ_mm: 0.87; CompType: IC; U/M: EA; PartNumber: TPS3702CX33DDCR; PackageReference: DDC0006A; PackageDescription: SOT-23-T-6; MountType: SMT; ComponentLink1Description: Datasheet Link; ComponentLink1URL: http://www.ti.com/lit/ds/symlink/tps3702.pdf; RoHS: Y; Publisher: Texas Instruments; LatestRevisionDate: 2017-06-09; Alternate Manufacturer: Texas Instruments
U5 = CMP-0066119-1: SIMPLE SWITCHER 2.7V to 5.5V, 2.1A Step-Up Regulator in SOT-23, DBV0005A (SOT-23-5); Alternate PartNumber: LMR62421XMFE/NOPB; Manufacturer: Texas Instruments; SizeArea_mm2: 8.12; SizeAreaWB_mm2: 14.82; SizeX_mm: 2.8; SizeY_mm: 2.9; SizeZ_mm: 1.45; CompType: IC; U/M: EA; Green_Lifecycle: Active; Green_REACh: Passed; PartNumber: LMR62421XMFX/NOPB; PackageReference: DBV0005A; PackageDescription: SOT-23-5; MountType: SMT; ComponentLink1Description: Datasheet Link; ComponentLink1URL: http://www.ti.com/lit/ds/symlink/lmr62421.pdf; RoHS: Y; Publisher: Texas Instruments; LatestRevisionDate: 2017-06-09; Alternate Manufacturer: Texas Instruments; Green_EU RoHS: Passed; Green_EU RoHS-2: Passed; Footprint Path 6: C:\AltiumLibraries\Footprints\TI\.PcbLib
U100 = CMP-0043115-2: ESD-Protection Array for High-Speed Data Interfaces, 4 Channels, -40 to +85 degC, 6-pin SON (DRY), Green (RoHS & no Sb/Br); Manufacturer: Texas Instruments; 1394 / Firewire: TRUE; Breakdown Voltage(Min)(V): 6; IEC 61000-4-2 Air-Gap(+/- kV): 12; IEC 61000-4-2 Contact(+/- kV): 8; IO Capacitance(Typ)(pF): 1.6; IO Leakage Current(nA): 1; SubFamily: ESD Solution; AEC Category: Q200; AEC Qualified: N; CompType: IC; SizeArea_mm2: 1.45; SizeAreaWB_mm2: 4.9; SizeX_mm: 1.0; SizeZ_mm: 0.6; DatasheetVersion: SLVS729A; PackageVersion: revF, Dec-2011; PackageReference: DRY0006A; PackageDescription: USON-6; Eco-Plan: Green (RoHS & no Sb/Br); Serial ATA / eSATA: TRUE; USB High Speed: TRUE; PartNumber: TPD4E004DRYR; ComponentLink1Description: Datasheet Link; ComponentLink1URL: http://www.ti.com/lit/ds/symlink/tpd4e004.pdf; ComponentLink2Description: Product Folder; ComponentLink2URL: http://www.ti.com/product/tpd4e004; ComponentLink3Description: Online Datasheet; ComponentLink3URL: http://www.ti.com/product/tpd4e004/datasheet; Mounting Technology: Surface Mount; MountType: SMT; RoHS: Y; SizeY_mm: 1.45
U101 = CMP-0036402-3: Single Output High PSRR LDO, 1 A, Adjustable 1.2 to 5.5 V Output, 2.7 to 5.5 V Input, 8-pin SON (DRB), -40 to 125 degC, Green (RoHS & no Sb/Br); Manufacturer: Texas Instruments; Accuracy(%): 2; Iout(Max)(A): 1; Iq(Typ)(mA): 0.26; SubFamily: Single Channel LDO; Vdo(Typ)(mV): 250; Vin(Max)(V): 5.5; Vin(Min)(V): 2.7; Vout Adj(Min)(V): 1.2; AEC Category: Q200; AEC Qualified: N; CompType: IC; SizeAreaWB_mm2: 16.0; SizeArea_mm2: 9.0; SizeX_mm: 3.0; SizeZ_mm: 1.0; DatasheetVersion: SLVS351N; PackageVersion: 4203482-2/K; PackageReference: DRB0008B; PackageDescription: VSON-8; Eco-Plan: Green (RoHS & no Sb/Br); Vout Adj(Max)(V): 5.5; PartNumber: TPS79601DRBR; ComponentLink1Description: Manufacturer URL; ComponentLink1URL: http://www.ti.com/; ComponentLink2Description: Datasheet; ComponentLink2URL: http://www.ti.com/general/docs/lit/getliterature.tsp?genericPartNumber=TPS79601&fileType=pdf; ComponentLink3Description: Package Specification; ComponentLink3URL: http://www.ti.com/litv/pdf/mpds118h; MountType: SMT; RoHS: Y; SizeY_mm: 3.0
USB101 = CMP-0055311-1: Receptacle, USB 2.0, Micro B, 5 Position, R/A, SMT; Manufacturer: Molex; Pitch_mm: 0.65; Gender: Female; ContactFinish: Gold; Current_A: 1.8A; Voltage_V: 30V; Cert_UL: Y; CNHeader: FALSE; CT: TRUE; PartNumber: 1051640001; PackageReference: Receptacle, USB 2.0, Micro B, 5 Pos, 0.65mm Pitch, R/A, SMT; CompType: USB; RoHS: Y; MountType: SMT; ComponentLink1Description: Datasheet URL; ComponentLink1URL: http://www.molex.com/pdm_docs/sd/1051640001_sd.pdf; Orientation: R/A; PinCount: 5; Color: Black; Publisher: Texas Instruments; LatestRevisionDate: 26/05/2017; Supplier 1: Digi-Key; Supplier Part Number 1: WM11263CT-ND; Supplier 2: Newark; Supplier Part Number 2: 99Y3224; Supplier 3: Mouser; Supplier Part Number 3: 538-105164-0001

## Nets that join several sheets
+3V3: MCU025A_Connectors (5 pins), MCU025A_AltRouting_Misc (16 pins), MCU025A_XDS110_USB_Power (21 pins)
+5V0: MCU025A_Connectors (10 pins), MCU025A_AltRouting_Misc (C42.2 U7.15), MCU025A_XDS110_USB_Power (5 pins)
GND: MCU025A_Connectors (20 pins), MCU025A_AltRouting_Misc (25 pins), MCU025A_XDS110_USB_Power (24 pins)
EQEP1A: MCU025A_Connectors (C43.1 J12.1 R48.1), MCU025A_AltRouting_Misc (U7.16)
EQEP1B: MCU025A_Connectors (C44.1 J12.2 R49.1), MCU025A_AltRouting_Misc (U7.14)
EQEP1I: MCU025A_Connectors (C45.1 J12.3 R50.1), MCU025A_AltRouting_Misc (U7.13)
EQEP2A: MCU025A_Connectors (C46.1 J13.1 R51.1), MCU025A_AltRouting_Misc (U7.12)
EQEP2B: MCU025A_Connectors (C47.1 J13.2 R52.1), MCU025A_AltRouting_Misc (U7.11)
EQEP2I: MCU025A_Connectors (C48.1 J13.3 R53.1), MCU025A_AltRouting_Misc (U7.10)
GPIO6_BP: MCU025A_Connectors (J6.38), MCU025A_AltRouting_Misc (R44.2)
GPIO6_FSITXDO: MCU025A_Connectors (J11.6), MCU025A_AltRouting_Misc (R44.1)
GPIO7_BP: MCU025A_Connectors (J6.37), MCU025A_AltRouting_Misc (R45.2)
GPIO7_FSITXCLK: MCU025A_Connectors (J11.2), MCU025A_AltRouting_Misc (R45.1)
GPIO12_BP: MCU025A_Connectors (J6.11), MCU025A_AltRouting_Misc (R47.2)
GPIO12_FSIRXD0: MCU025A_Connectors (J11.5), MCU025A_AltRouting_Misc (R47.1)
GPIO14_BP: MCU025A_Connectors (J6.32), MCU025A_AltRouting_Misc (U8.13)
GPIO15_BP: MCU025A_Connectors (J6.33), MCU025A_AltRouting_Misc (U8.1)
GPIO18_BP: MCU025A_Connectors (J2.32), MCU025A_AltRouting_Misc (R28.1)
GPIO23: MCU025A_Connectors (J2.12), MCU025A_AltRouting_Misc (R38.1)
GPIO24: MCU025A_Connectors (J6.15), MCU025A_AltRouting_Misc (R33.1 S2.2)
GPIO26_BP: MCU025A_Connectors (J6.34), MCU025A_AltRouting_Misc (U8.3)
GPIO28_BP: MCU025A_Connectors (J5.3), MCU025A_AltRouting_Misc (S6.1)
GPIO29_BP: MCU025A_Connectors (J5.4), MCU025A_AltRouting_Misc (S6.4)
GPIO32_BP: MCU025A_Connectors (J6.31), MCU025A_AltRouting_Misc (S9.6)
GPIO32_CANTX: MCU025A_Connectors (U10.1), MCU025A_AltRouting_Misc (S9.4)
GPIO33_BP: MCU025A_Connectors (J6.13), MCU025A_AltRouting_Misc (S9.3)
GPIO33_CANRX: MCU025A_Connectors (U10.4), MCU025A_AltRouting_Misc (S9.1)
GPIO33_FSIRXCLK: MCU025A_Connectors (J11.1), MCU025A_AltRouting_Misc (R46.1)
GPIO34: MCU025A_Connectors (J6.12), MCU025A_AltRouting_Misc (R39.1)
GPIO35_BP: MCU025A_Connectors (J1.10), MCU025A_AltRouting_Misc (S4.6)
GPIO37_BP: MCU025A_Connectors (J1.9), MCU025A_AltRouting_Misc (S4.3)
GPIO59_BP: MCU025A_Connectors (J2.11), MCU025A_AltRouting_Misc (U9.3)
XRSn: MCU025A_Connectors (J2.16 J6.16), MCU025A_AltRouting_Misc (C37.2 R32.1 S1.4), MCU025A_XDS110_USB_Power (C7.1 R4.1 R5.2)

## Assembly variants
001: not fitted C44 C45 C46 C47 C48 C62 FID1 FID2 FID3 FID4 FID5 FID6 J3 R16 R22 R31 R38 R54